# Altium schematic sheet Sheet1.SchDoc
size A; SheetNumber: 1; SheetTotal: 1; SPICEModelCacheMJYHIYLD: <root> / <DocumentId>MJYHIYLD</DocumentId> / <CacheFrame Number="0"> / <Model Name="861011084015_680uf" Kind="CKT"> / <Text>******* / .subckt 861011084015_680uF 1 2 / Rser 1 3 0.12221 / Lser 2 4 1.6423797781E-08 / C1 3 4 0.00068 / Rpar 3 4 73529.4117647059 / .ends 861011084015_680uF</Text> / </Model> / </CacheFrame> / </root>
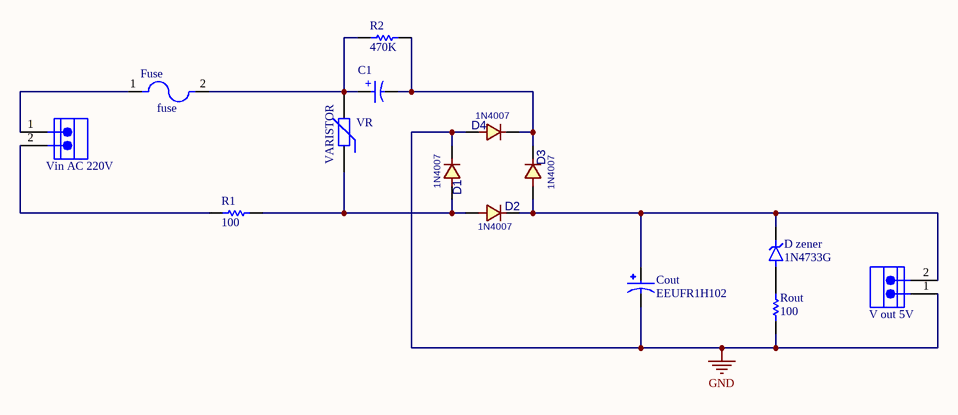
[diagram p0: Sheet1.SchDoc]

## Parts
C1  680µF  [WCAP-AIG8_D25H30]  (value not drawn)
Cout  EEUFR1H102  [CAPPRD750W80D1600H2500]
D1  value 1N4007  [D_AX04_DO41]  (hidden comment: 1N4007 THD)
D2  value 1N4007  [D_AX04_DO41]  (hidden comment: 1N4007 THD)
D3  value 1N4007  [D_AX04_DO41]  (hidden comment: 1N4007 THD)
D4  value 1N4007  [D_AX04_DO41]  (hidden comment: 1N4007 THD)
D_zener  1N4733G  [DIOAD1036W73L450D282]
Fuse  fuse  [FUSAD2668W81L2100D550]
R1  value 100  [R2W_AX08]  (hidden comment: Resistor THD)
R2  value 470K  [R2W_AX08]  (hidden comment: Resistor THD)
Rout  value 100  [Res_0.25w]  (hidden comment: Resistor THD)
V_out_5V  Socket Blue 2  [Socket Blue 2]  (value not drawn)
Vin_AC_220V  Socket Blue 2  [Socket Blue 2]  (value not drawn)
VR  VARISTOR  [07D XXX]

## Nets
GND: Cout.N D1.2 D4.1 Rout.1 V_out_5V.1
NetC1_1: C1.1(P) Fuse.2 R2.1 VR.2
NetC1_2: C1.2(N) D3.2 D4.2 R2.2
NetCout_P: Cout.P D2.2 D3.1 D_zener.C(K) V_out_5V.2
NetD1_1: D1.1 D2.1 R1.2 VR.1
NetD_zener_A: D_zener.A Rout.2
NetFuse_1: Fuse.1 Vin_AC_220V.1
NetR1_1: R1.1 Vin_AC_220V.2

## Notes on the sheet
- (in symbol 861011084015) +

## Library data of the parts
C1 = 861011084015: WCAP-AIG8 Aluminum Electrolytic Capacitor, Snap-In, D25 x H30mm, 680µF, 200V; Manufacturer: Wurth Elektronik; Capacitance Tolerance: +/-20%; Dissipation Factor: 15%; Endurance: 2000h; Leakage Current: 2720µA; Ripple Current: 2.98A; Technical Reference: ANAO300681M200DSIC3B000; Manufacturer Part Number: 861011084015; Category: Aluminum Electrolytic Capacitors; Match Code: WCAP-AIG8; ComponentLink1Description: Website Link; ComponentLink1URL: https://www.we-online.com/redexpert/article/861011084015?ad; ComponentLink2Description: Datasheet Link; ComponentLink2URL: https://www.we-online.com/redexpert/spec/861011084015?ad; Mount: Through Hole; Min Operating Temperature: -25°C; Max Operating Temperature: 85°C; Packaging: Tray; Case/Size Code: D25 x H30mm; Height: 30mm; Diameter: 25mm; Capacitance: 680µF; Rated Voltage (DC): 200V
Cout = EEUFR1H102: 1000ÂµF 50V Aluminum Electrolytic Capacitors Radial, Can 10000 Hrs @ 105Â°C; MF: Panasonic; Value: *; Price: None; Package: RADIAL-2 Panasonic; Availability: In Stock; Check_prices: https://www.snapeda.com/parts/EEUFR1H102/Panasonic/view-part/2301894/?ref=eda; MP: EEUFR1H102; SnapEDA_Link: https://www.snapeda.com/parts/EEUFR1H102/Panasonic/view-part/2301894/?ref=snap
D1-D4 = 1N4007 THD: DIODE, GENERAL PURPOSE, 1000V/1A; DatasheetVersion: 2022; ComponentLink1Description: Tarahiboard; ComponentLink1URL: https://www.tarahiboard.com/product/library-pack
Fuse = 5SFP-1-R: 1 A 250 V AC DC Fuse Cartridge, Glass Through Hole 5mm x 20mm (Axial); MF: Bel Fuse; MP: 5SFP 1-R; SnapEDA_Link: https://www.snapeda.com/parts/5SFP%201-R/Bel+Circuit+Protection/view-part/?ref=snap; Package: 5mm-20 Bel Fuse Inc.; Value: *; Check_prices: https://www.snapeda.com/parts/5SFP%201-R/Bel+Circuit+Protection/view-part/?ref=eda
VR = VARISTOR (VDR): VARISTORS; ComponentLink1Description: Tarahiboard; ComponentLink1URL: https://www.tarahiboard.com/product/library-pack; DatasheetVersion: 2022
D_zener = 1N4733G: Package: None; Value: *; Price: None; MP: 1N4733G; Availability: Unavailable
R1 R2 Rout = Resistor THD: DatasheetVersion: 2022; ComponentLink1Description: Website: Tarahiboard; ComponentLink1URL: https://www.tarahiboard.com/product/library-pack
V_out_5V Vin_AC_220V = Socket Blue 2: ComponentLink1Description: Tarahiboard; ComponentLink1URL: https://www.tarahiboard.com/product/library-pack; DatasheetVersion: 2022